# EasyEDA schematic SCH_d_02_e_01.json
TITLE: Sheet_1; REV: 1.0; Date: 2025-01-15; Sheet: 1/1; Drawn By: artem.v.ulyanov; Company: Your Company
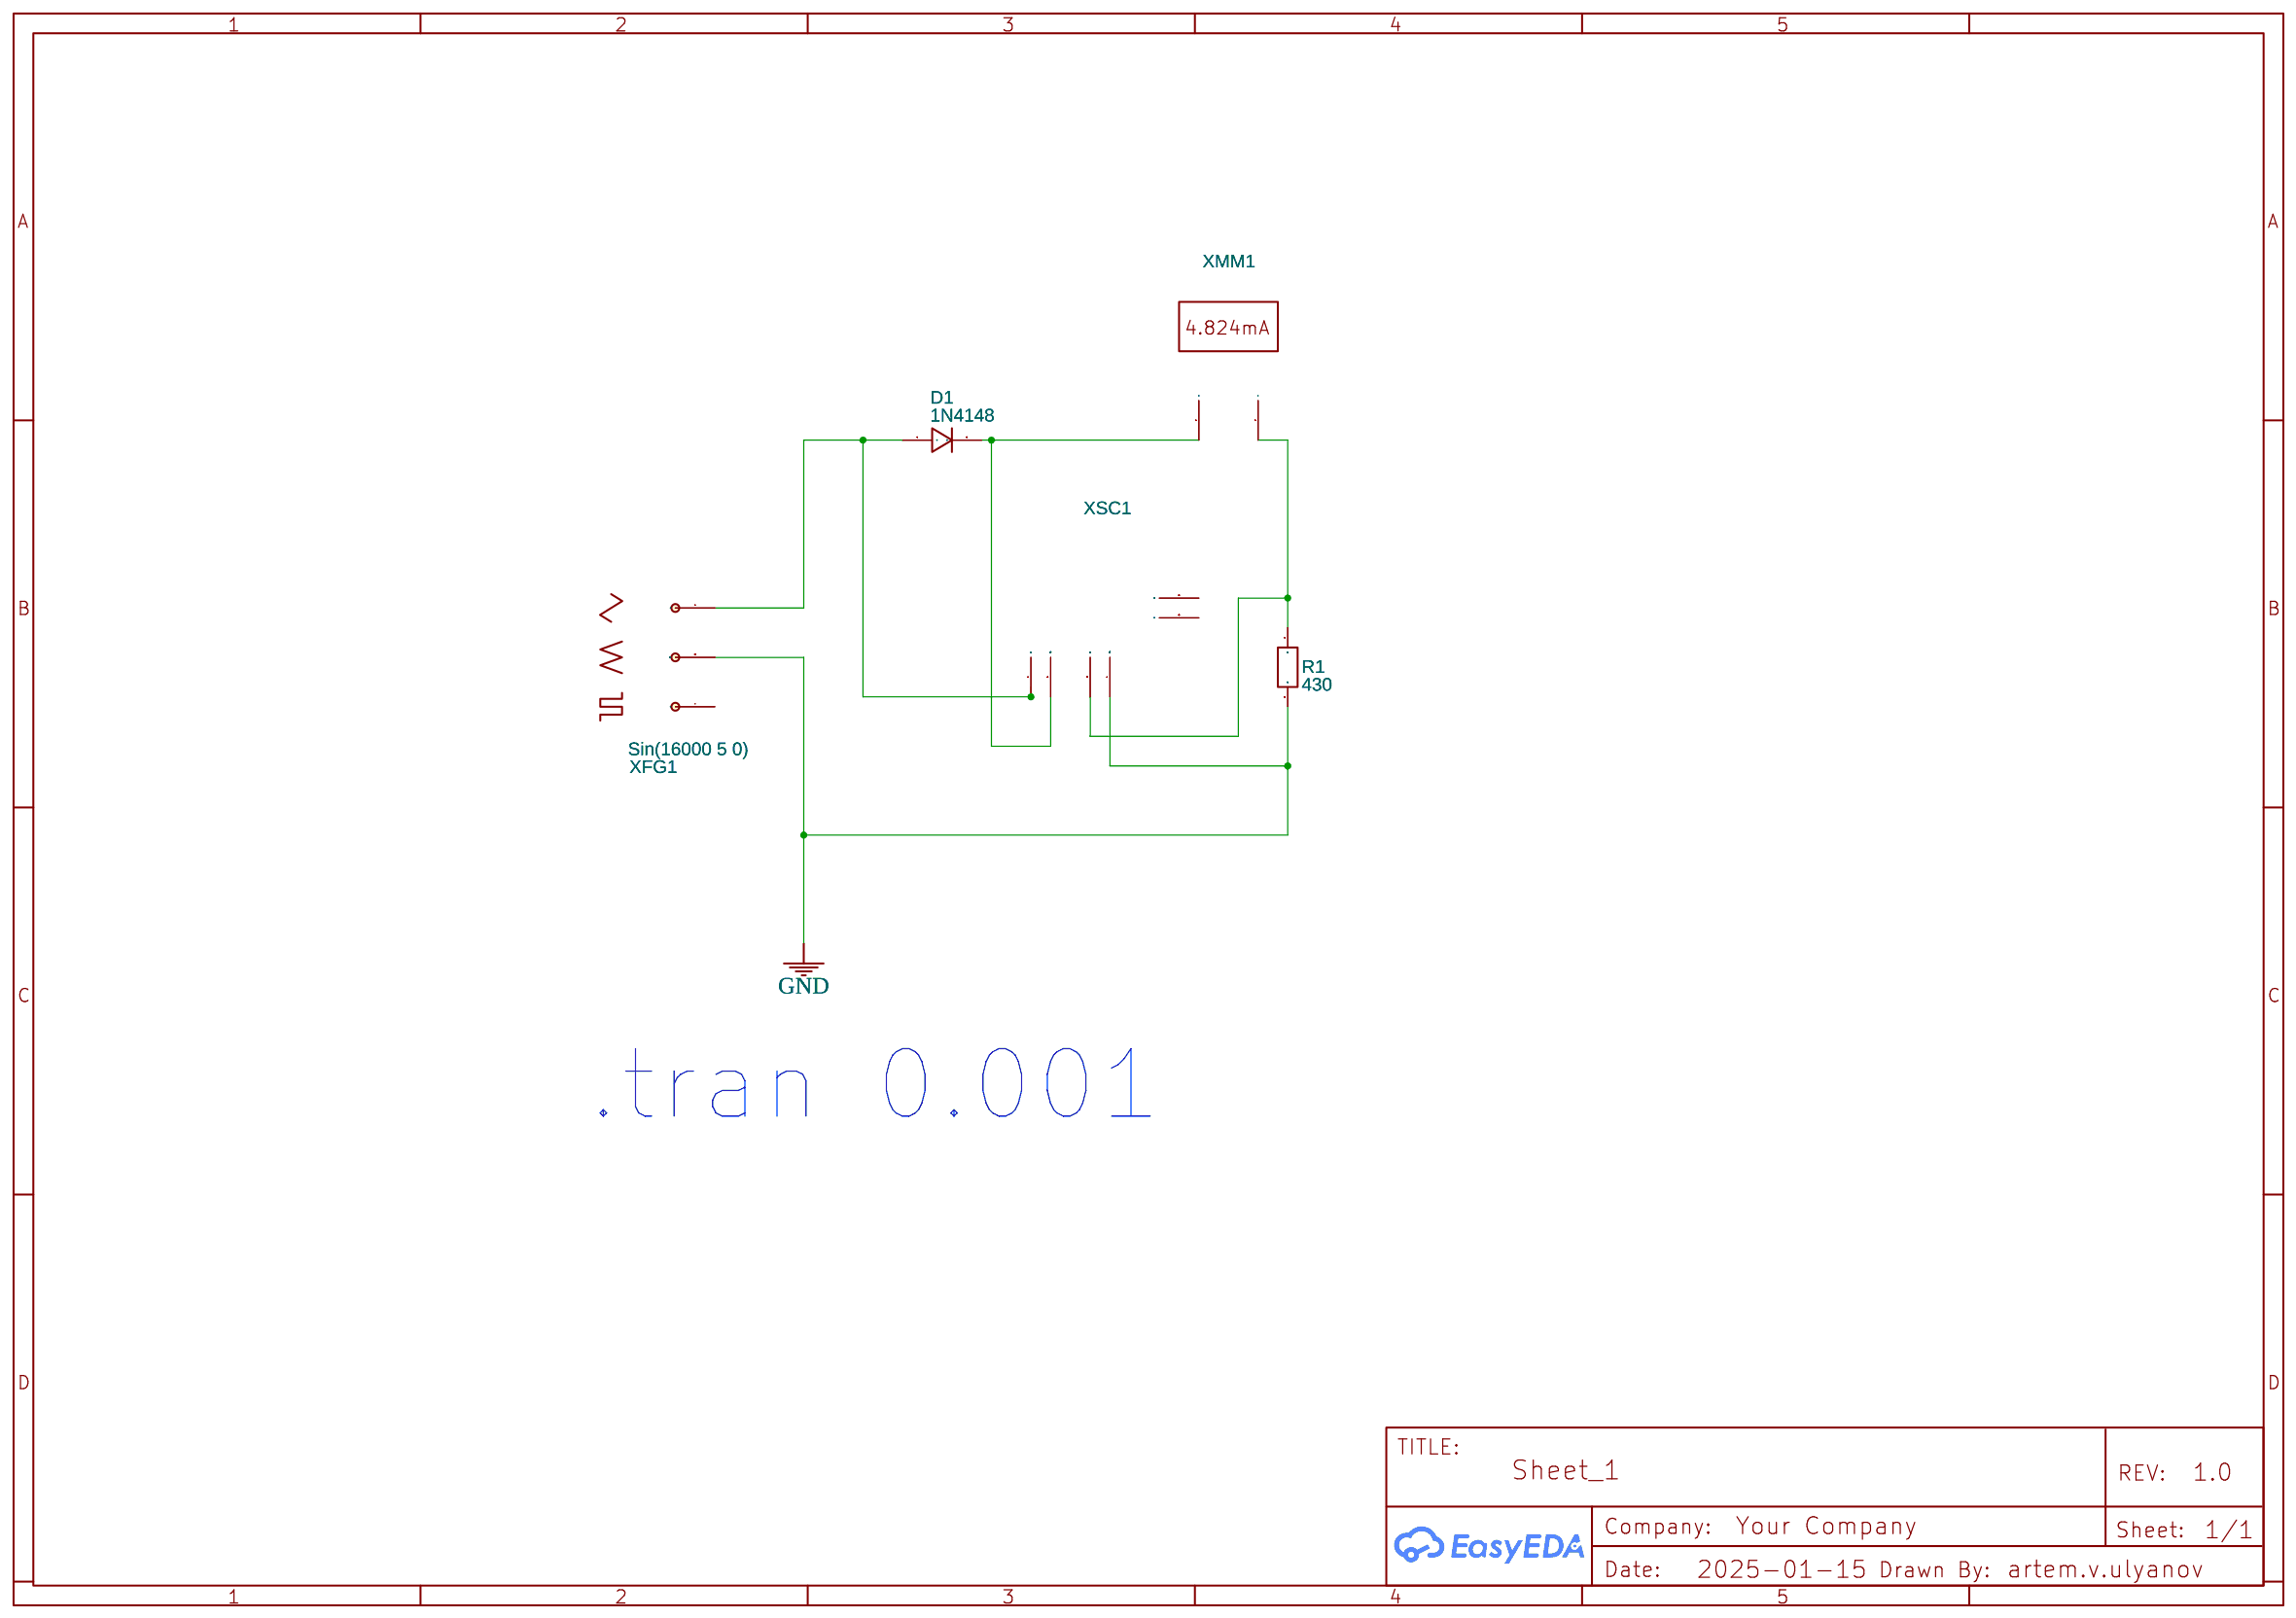
[diagram p0: schematic sheet]

## Parts
D1  1N4148  [DO-35]
R1  430  [R0603]
XFG1  Sin(16000 5 0)
XMM1  Multimeter
XSC1  Oscilloscope

## Library data of the parts
D1 = 1N4148: Contributor: EasyEDA
R1 = R_0603_EU: Contributor: LCEDA_Lib
XFG1 = FUNCTIONGENERATOR: Supplier: LCSC; Waveforms: Sine Wave; Frequency: 16000; Duty cycle: 50; Amplitude: 5; Offset: 0; Rise/Fall Time: 10; NameDisplay: 1; Contributor: EasyEDA; sim: true
XMM1 = MULTIMETER: Supplier: LCSC; Multimeter Type: Amper; Power Type: AC; Voltmeter resistance: 10μ; Ammeter resistance: 1G; NameDisplay: 0; Contributor: EasyEDA; sim: true
XSC1 = OSCILLOSCOPE: Contributor: EasyEDA; NameDisplay: 0; sim: true

## Nets
GND: R1.2 XFG1.COM XSC1.4(GND2)
Net-(D1-1): D1.1(A) XFG1.+ XSC1.1(A)
Net-(D1-2): D1.2(K) XMM1.1(+) XSC1.2(GND1)
Net-(R1-1): R1.1 XMM1.2(I) XSC1.3(B)

Not connected (* = marked no-connect by the designer): XFG1 -; XSC1 5(T+) 6(T-)

## Notes on the sheet
- .tran 0.001
